# Altium schematic sheet Coloring.SchDoc
size 88 x 127 mm; SheetNumber: 10; SheetTotal: 10
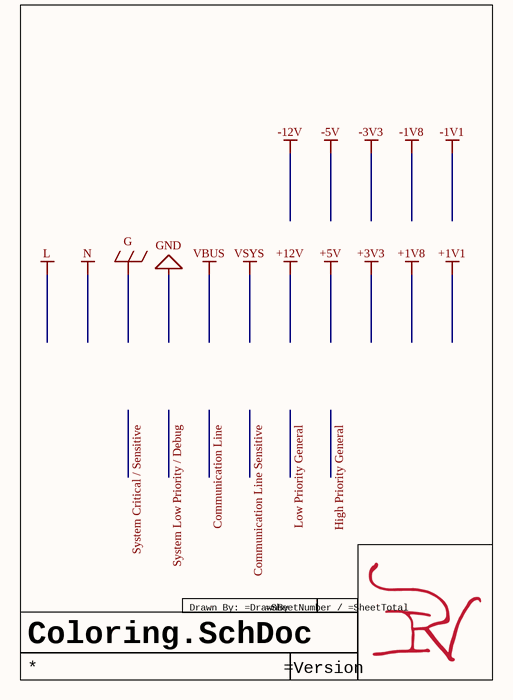
[diagram p0: Coloring.SchDoc]

## Notes on the sheet
- Drawn By: =DrawnBy